# EAGLE schematic ODGIRON-v1.0-F103-0413 (EAGLE 9.6.2)
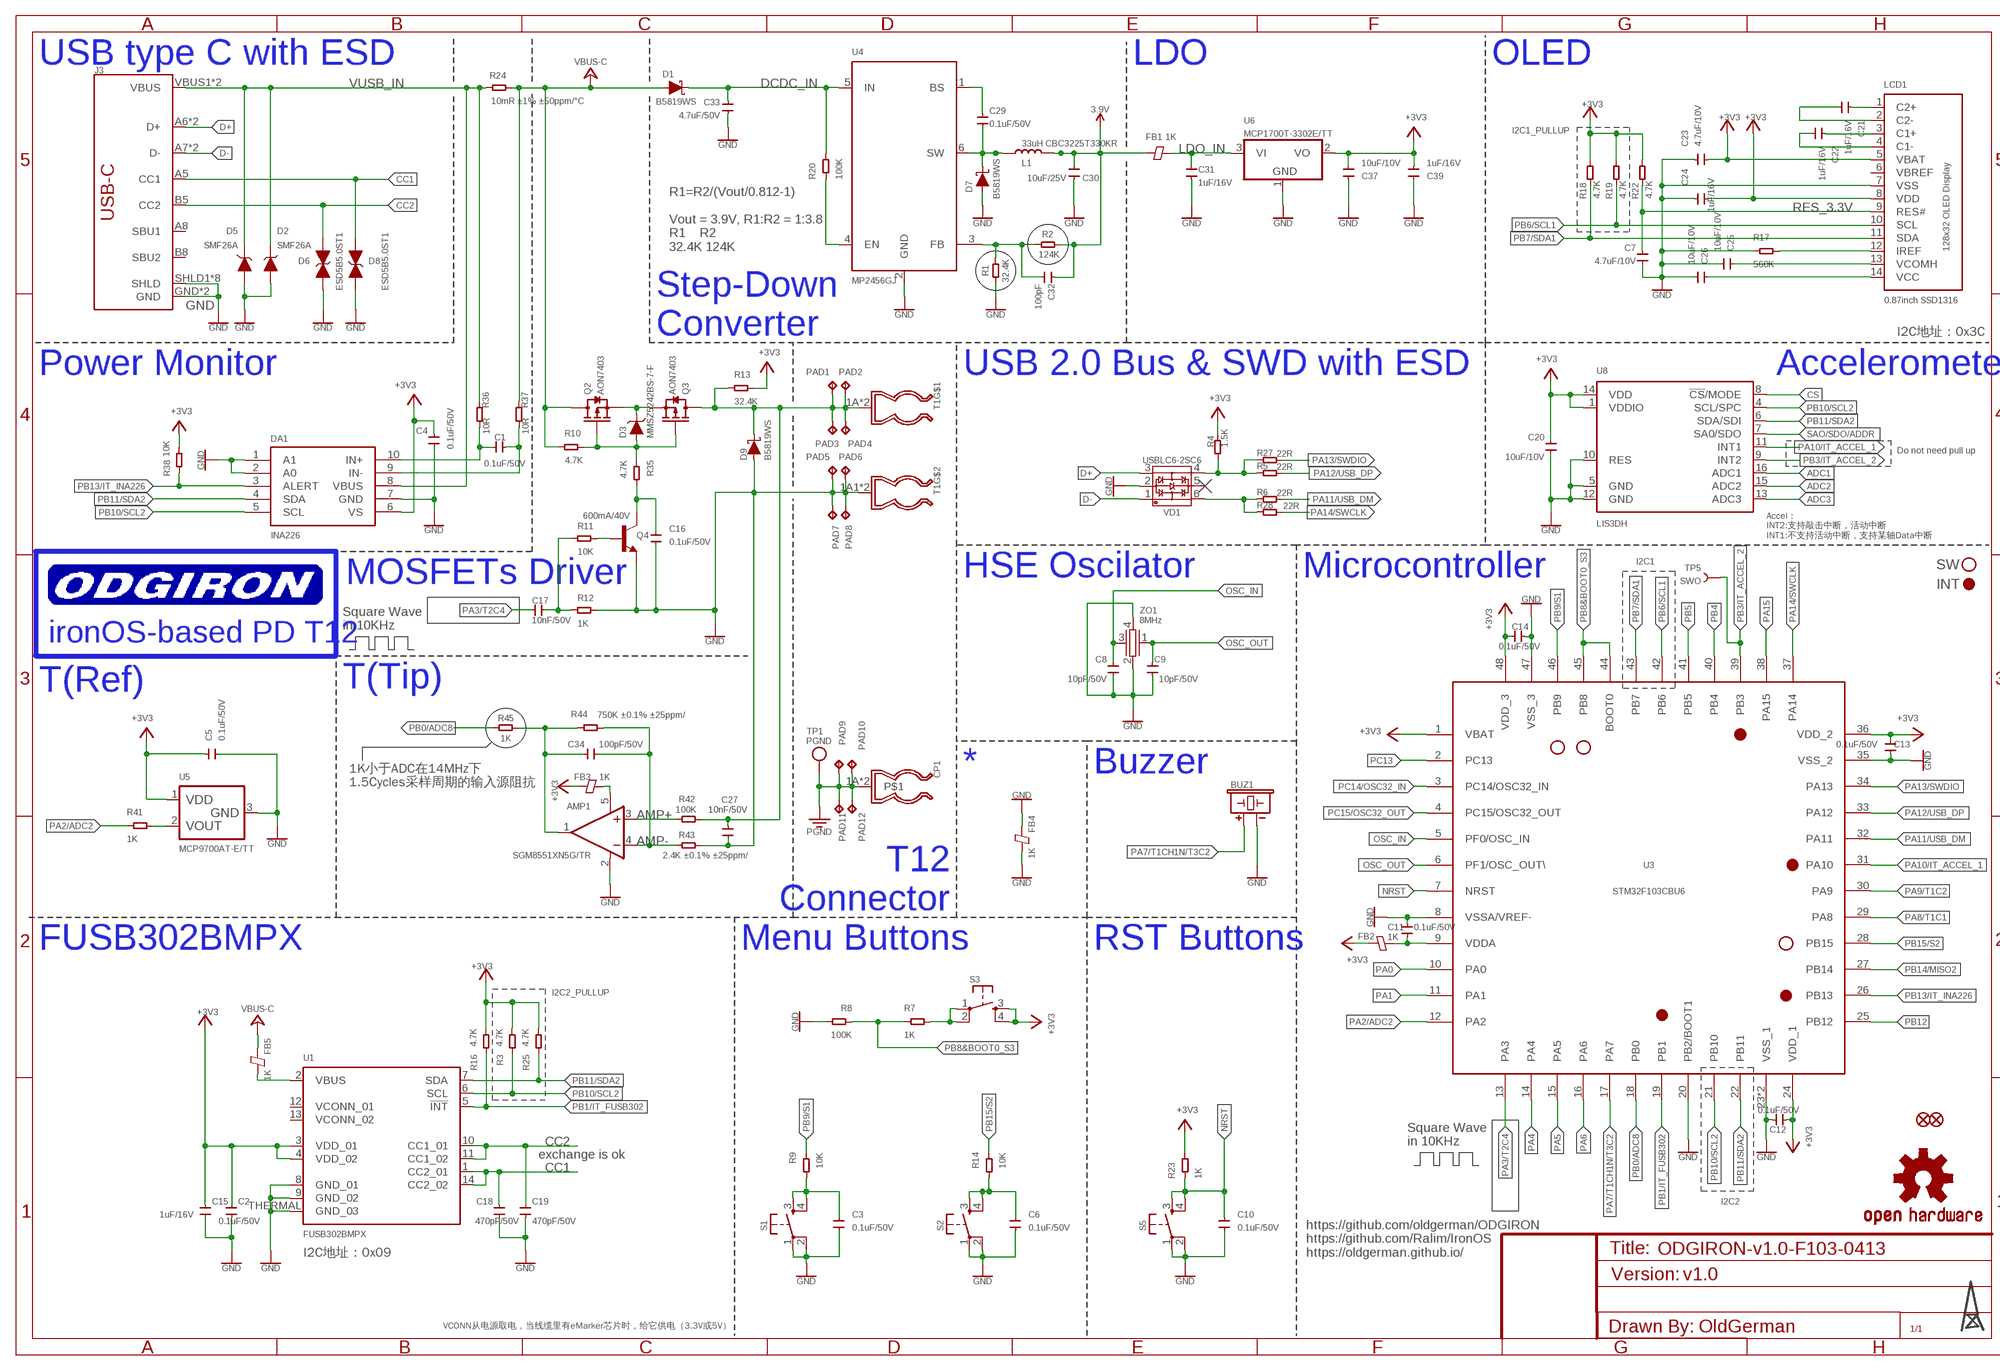
[diagram p0: schematic, sheet 1, part 1 of 2]
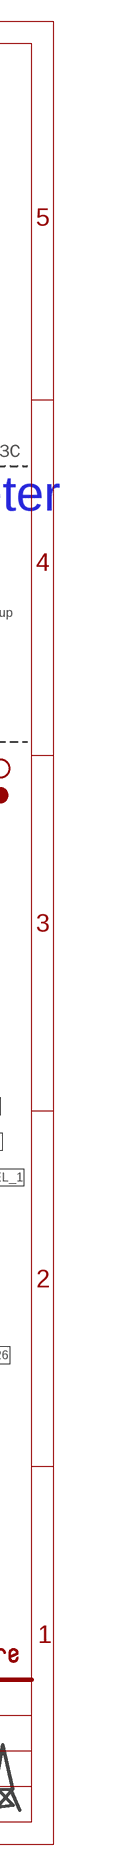
[diagram p1: schematic, sheet 1, part 2 of 2]

## Parts
AMP1  SGM8551XN5G/TR  AMP_SIMGLEN  [SOT23-5]
BUZ1  BUZZERBUZZER_5020  [BUZZER_5020]
C1  0.1uF/50V  SEEED_CAP-0603  [C0603]
C2  0.1uF/50V  SEEED_CAP-0603  [C0603]
C3  0.1uF/50V  SEEED_CAP-0603  [C0603]
C4  0.1uF/50V  SEEED_CAP-0603  [C0603]
C5  0.1uF/50V  SEEED_CAP-0603  [C0603]
C6  0.1uF/50V  SEEED_CAP-0603  [C0603]
C7  4.7uF/10V  SEEED_CAP-0603  [C0603]
C8  10pF/50V  SEEED_CAP-0603  [C0603]
C9  10pF/50V  SEEED_CAP-0603  [C0603]
C10  0.1uF/50V  SEEED_CAP-0603  [C0603]
C11  0.1uF/50V  SEEED_CAP-0603  [C0603]
C12  0.1uF/50V  SEEED_CAP-0603  [C0603]
C13  0.1uF/50V  SEEED_CAP-0603  [C0603]
C14  0.1uF/50V  SEEED_CAP-0603  [C0603]
C15  1uF/16V  SEEED_CAP-0603  [C0603]
C16  0.1uF/50V  SEEED_CAP-0603  [C0603]
C17  10nF/50V  SEEED_CAP-0603  [C0603]
C18  470pF/50V  SEEED_CAP-0603  [C0603]
C19  470pF/50V  SEEED_CAP-0603  [C0603]
C20  10uF/10V  SEEED_CAP-0603  [C0603]
C21  1uF/16V  SEEED_CAP-0603  [C0603]
C22  1uF/16V  SEEED_CAP-0603  [C0603]
C23  4.7uF/10V  SEEED_CAP-0603  [C0603]
C24  1uF/16V  SEEED_CAP-0603  [C0603]
C25  10uF/10V  SEEED_CAP-0603  [C0603]
C26  10uF/10V  SEEED_CAP-0603  [C0603]
C27  10nF/50V  SEEED_CAP-0603  [C0603]
C29  0.1uF/50V  SEEED_CAP-0603  [C0603]
C30  10uF/25V  SEEED_CAP-0805  [C0805]
C31  1uF/16V  SEEED_CAP-0603  [C0603]
C32  100pF  SEEED_CAP-0603  [C0603]
C33  4.7uF/50V  SEEED_CAP-0805  [C0805]
C34  100pF/50V  SEEED_CAP-0603  [C0603]
C37  10uF/10V  SEEED_CAP-0603  [C0603]
C39  1uF/16V  SEEED_CAP-0603  [C0603]
CP1  FUSE_CLIPS_01  [FUSE_CLIPS_01]
D1  B5819WS  DIODE_SCHOTTKYSOD323  [SOD-323]
D2  SMF26A  DIODE-TVS_UNIDIRECTIONALSOD-123  [SOD-123]
D3  MMSZ5242BS-7-F  DIODE_ZENERSOD-323  [SOD-323]
D5  SMF26A  DIODE-TVS_UNIDIRECTIONALSOD-123  [SOD-123]
D6  ESD5B5.0ST1  DIODE-TVS_BI−DIRECTIONALSOD-523  [SOD-523]
D7  B5819WS  DIODE_SCHOTTKYSOD323  [SOD-323]
D8  ESD5B5.0ST1  DIODE-TVS_BI−DIRECTIONALSOD-523  [SOD-523]
D9  B5819WS  DIODE_SCHOTTKYSOD323  [SOD-323]
DA1  INA226  [MSOP10]
FB1  1K  FERRITE-BEAD-0603  [F0603]
FB2  1K  FERRITE-BEAD-0603  [F0603]
FB3  1K  FERRITE-BEAD-0603  [F0603]
FB4  1K  FERRITE-BEAD-0603  [F0603]
FB5  1K  FERRITE-BEAD-0603  [F0603]
FID1  FIDUCIAL  [FIDUCIAL_1MM]
FID2  FIDUCIAL  [FIDUCIAL_1MM]
J3  USB_C_LONG-SYMBOL2-LAYER  [USB-C-16P]
L1  33uH CBC3225T330KR  INDUCTOR3225  [SMD,3.2X2.5X2.5MM]
LCD1  0.87inch SSD1316  0.87INCH_OLED_128X32_SSD1306  [0.87INCH_128X32_OLED_SSD1306]
LOGO1  OSHW-LOGONO_SILK  [DUMMY]
PAD1  PADTP16SQ  [TP16SQ]
PAD2  PADTP16SQ  [TP16SQ]
PAD3  PADTP16SQ  [TP16SQ]
PAD4  PADTP16SQ  [TP16SQ]
PAD5  PADTP16SQ  [TP16SQ]
PAD6  PADTP16SQ  [TP16SQ]
PAD7  PADTP16SQ  [TP16SQ]
PAD8  PADTP16SQ  [TP16SQ]
PAD9  PADTP16SQ  [TP16SQ]
PAD10  PADTP16SQ  [TP16SQ]
PAD11  PADTP16SQ  [TP16SQ]
PAD12  PADTP16SQ  [TP16SQ]
Q2  AON7403  MOSFET-P-AON7403  [DFN8P-0.65-3X3X0.8MM]
Q3  AON7403  MOSFET-P-AON7403  [DFN8P-0.65-3X3X0.8MM]
Q4  600mA/40V  TRANS_NPN-MMBT2222AL  [SOT23-3]
R1  32.4K  SEEED_RES-0603  [R0603]
R2  124K  SEEED_RES-0603  [R0603]
R3  4.7K  SEEED_RES-0603  [R0603]
R4  1.5K  SEEED_RES-0603  [R0603]
R5  22R  SEEED_RES-0603  [R0603]
R6  22R  SEEED_RES-0603  [R0603]
R7  1K  SEEED_RES-0603  [R0603]
R8  100K  SEEED_RES-0603  [R0603]
R9  10K  SEEED_RES-0603  [R0603]
R10  4.7K  SEEED_RES-0603  [R0603]
R11  10K  SEEED_RES-0603  [R0603]
R12  1K  SEEED_RES-0603  [R0603]
R13  32.4K  SEEED_RES-0603  [R0603]
R14  10K  SEEED_RES-0603  [R0603]
R16  4.7K  SEEED_RES-0603  [R0603]
R17  560K  SEEED_RES-0603  [R0603]
R18  4.7K  SEEED_RES-0603  [R0603]
R19  4.7K  SEEED_RES-0603  [R0603]
R20  100K  SEEED_RES-0603  [R0603]
R22  4.7K  SEEED_RES-0603  [R0603]
R23  1K  SEEED_RES-0603  [R0603]
R24  10mR ±1% ±50ppm/°C  SEEED_RES-1206  [R1206]
R25  4.7K  SEEED_RES-0603  [R0603]
R27  22R  SEEED_RES-0603  [R0603]
R28  22R  SEEED_RES-0603  [R0603]
R35  4.7K  SEEED_RES-0603  [R0603]
R36  10R  SEEED_RES-0603  [R0603]
R37  10R  SEEED_RES-0603  [R0603]
R38  10K  SEEED_RES-0603  [R0603]
R41  1K  SEEED_RES-0603  [R0603]
R42  100K  SEEED_RES-0603  [R0603]
R43  2.4K ±0.1% ±25ppm/℃  SEEED_RES-0603  [R0603]
R44  750K ±0.1% ±25ppm/℃  SEEED_RES-0603  [R0603]
R45  1K  SEEED_RES-0603  [R0603]
S1  TAC_SWITCHSMD  [TACTILE_SWITCH_SMD]
S2  TAC_SWITCHSMD  [TACTILE_SWITCH_SMD]
S3  TAC_SWITCHSMD  [TACTILE_SWITCH_SMD]
S5  TAC_SWITCHSMD  [TACTILE_SWITCH_SMD]
T1  HAKKO_T12_K-TYPE_WITH_FUSE_CLIPS_X2  [HAKKO_T12_K-TYPE_WITH_FUSE_CLIPS_X2]
TP1  PGND  TESTPOINTROUND2MM  [TESTPOINT_ROUND_2MM]
TP5  SWO  TEST-POINT3  [PAD.03X.03]
U1  FUSB302BMPX  FUSB302  [QFN14-2.5X2.5MM]
U3  STM32F103CBU6  STM32F1_QFN48  [QFN48_7X7MM_0.5MM]
U4  MP2456GJ  MP2456  [SOT23-6]
U5  MCP9700AT-E/TT  MCP9700  [SOT23-3@1]
U6  MCP1700T-3302E/TT  MCP1700  [SOT23-3]
U8  LIS3DH  [LGA-16-3X3]
VD1  USBLC6-2SC6  USBLC6-2SOT23-6  [SOT23-6]
ZO1  8MHz  3225_CRYSTALL  [3.2X2.5_KX-7]

## Nets
3.9V: C30.1 C32.1 FB1.1 L1.2 R2.1
+3V3: C2.1 C4.1 C5.1 C12.2 C13.2 C14.2 C15.1 C20.2 C23.2 C24.2 C37.2 C39.2 DA1.6(VS) FB2.2 FB3.2 LCD1.5(VBAT) LCD1.8(VDD) R3.1 R4.2 R13.2 R16.1 R18.2 R19.2 R22.2 R23.2 R25.1 R38.1 S3.3 S3.4 U1.3(VDD_01) U1.4(VDD_02) U3.1(VBAT) U3.24(VDD_1) U3.36(VDD_2) U3.48(VDD_3) U5.1(VDD) U6.2(VO) U8.1(VDDIO) U8.14(VDD)
ADC1: U8.16(ADC1)
ADC2: U8.15(ADC2)
ADC3: U8.13(ADC3)
AMP+: AMP1.3(+IN) R42.1
AMP-: AMP1.4(-IN) C34.2 R43.1 R44.2
BS: C29.1 U4.1(BS)
CC1: C18.1 D8.K(C) J3.A5(CC1) U1.1(CC2_01) U1.14(CC2_02)
CC2: C19.1 D6.K(C) J3.B5(CC2) U1.10(CC1_01) U1.11(CC1_02)
CS: U8.8(!CS!/MODE)
D+: J3.A6(D+) J3.B6(D+) VD1.3
D-: J3.A7(D-) J3.B7(D-) VD1.1
DCDC_IN: C33.1 D1.C R20.2 U4.5(IN)
EN: R20.1 U4.4(EN)
GND: AMP1.2(V-) BUZ1.-(LEAD-) C2.2 C3.2 C4.2 C5.2 C6.2 C7.2 C8.1 C9.1 C10.2 C11.1 C12.1 C13.1 C14.1 C15.2 C16.1 C18.2 C19.2 C20.1 C23.1 C24.1 C25.2 C26.2 C27.2 C30.2 C31.1 C33.2 C37.1 C39.1 D2.A D5.A D6.A D7.A D8.A D9.A DA1.1(A1) DA1.2(A0) DA1.7(GND) FB4.1 FB4.2 J3.GND J3.GND2(GND) J3.SHLD1(SHLD) J3.SHLD2(SHLD) J3.SHLD3(SHLD) J3.SHLD4(SHLD) J3.SHLD5(SHLD) J3.SHLD6(SHLD) J3.SHLD7(SHLD) J3.SHLD8(SHLD) LCD1.7(VSS) PAD5.TP PAD6.TP PAD7.TP PAD8.TP Q4.2(E) R1.1 R8.2 R12.1 R17.1 R43.2 S1.1 S1.2 S2.1 S2.2 S5.1 S5.2 T1.1A1 T1.1B1 U1.8(GND_01) U1.9(GND_02) U1.THERMAL(GND_03) U3.8(VSSA/VREF-) U3.20(PB2/BOOT1) U3.23(VSS_1) U3.35(VSS_2) U3.47(VSS_3) U3.P$1(VSS_1) U4.2(GND) U5.3(GND) U6.1(GND) U8.5(GND) U8.10(RES) U8.12(GND) VD1.2 ZO1.2 ZO1.4
LDO_IN: C31.2 FB1.2 U6.3(VI)
N$1: R4.1 R5.1 R27.1 VD1.4
N$2: R7.2 S3.1 S3.2
N$3: D3.C Q2.1(S) Q2.2(S) Q2.3(S) Q3.1(S) Q3.2(S) Q3.3(S)
N$4: C21.1 LCD1.1(C2+)
N$5: D3.A Q2.4(G) Q3.4(G) R10.2 R35.1
N$6: C22.1 LCD1.3(C1+)
N$7: C11.2 FB2.1 U3.9(VDDA)
N$8: C3.1 R9.2 S1.3 S1.4
N$11: C21.2 LCD1.2(C2-)
N$12: C6.1 R14.2 S2.3 S2.4
N$13: C22.2 LCD1.4(C1-)
N$14: C25.1 LCD1.13(VCOMH)
N$15: LCD1.12(IREF) R17.2
N$16: C26.1 LCD1.14(VCC)
N$17: Q4.1(B) R11.1
N$18: C32.2 R1.2 R2.2 U4.3(FB)
N$19: C16.2 Q4.3(C) R35.2
N$20: C17.1 R11.2 R12.2
N$21: AMP1.5(V+) FB3.1
N$22: R6.1 R28.1 VD1.6
N$23: FB5.1 U1.2(VBUS)
N$30: C1.1 DA1.10(IN+) R36.1
N$32: C1.2 DA1.9(IN-) R37.1
N$35: R41.2 U5.2(VOUT)
NRST: C10.1 R23.1 S5.3 S5.4 U3.7(NRST)
OSC_IN: C8.2 U3.5(PF0/OSC_IN) ZO1.3
OSC_OUT: C9.2 U3.6(PF1/OSC_OUT\) ZO1.1
OUT: AMP1.1(OUT) C34.1 R44.1 R45.2
PA0: U3.10(PA0)
PA1: U3.11(PA1)
PA2/ADC2: R41.1 U3.12(PA2)
PA3/T2C4: C17.2 U3.13(PA3)
PA4: U3.14(PA4)
PA5: U3.15(PA5)
PA6: U3.16(PA6)
PA7/T1CH1N/T3C2: BUZ1.+(LEAD+) U3.17(PA7)
PA8/T1C1: U3.29(PA8)
PA9/T1C2: U3.30(PA9)
PA10/IT_ACCEL_1: U3.31(PA10) U8.11(INT1)
PA11/USB_DM: R6.2 U3.32(PA11)
PA12/USB_DP: R5.2 U3.33(PA12)
PA13/SWDIO: R27.2 U3.34(PA13)
PA14/SWCLK: R28.2 U3.37(PA14)
PA15: U3.38(PA15)
PB0/ADC8: R45.1 U3.18(PB0)
PB1/IT_FUSB302: R16.2 U1.5(!INT) U3.19(PB1)
PB3/IT_ACCEL_2: TP5.P$1 U3.39(PB3) U8.9(INT2)
PB4: U3.40(PB4)
PB5: U3.41(PB5)
PB6/SCL1: LCD1.10(SCL) R19.1 U3.42(PB6)
PB7/SDA1: LCD1.11(SDA) R18.1 U3.43(PB7)
PB8&BOOT0_S3: R7.1 R8.1 U3.44(BOOT0) U3.45(PB8)
PB9/S1: R9.1 U3.46(PB9)
PB10/SCL2: DA1.5(SCL) R3.2 U1.6(SCL) U3.21(PB10) U8.4(SCL/SPC)
PB11/SDA2: DA1.4(SDA) R25.2 U1.7(SDA) U3.22(PB11) U8.6(SDA/SDI)
PB12: U3.25(PB12)
PB13/IT_INA226: DA1.3(ALERT) R38.2 U3.26(PB13)
PB14/MISO2: U3.27(PB14)
PB15/S2: R14.1 U3.28(PB15)
PC13: U3.2(PC13)
PC14/OSC32_IN: U3.3(PC14/OSC32_IN)
PC15/OSC32_OUT: U3.4(PC15/OSC32_OUT)
PGND: CP1.1A CP1.1B PAD9.TP PAD10.TP PAD11.TP PAD12.TP TP1.P$1
RES_3.3V: C7.1 LCD1.9(RES#) R22.1
SAO/SDO/ADDR: U8.7(SA0/SDO)
SW: C29.2 D7.C L1.1 U4.6(SW)
T12+: C27.1 D9.C PAD1.TP PAD2.TP PAD3.TP PAD4.TP Q3.5(D) Q3.6(D) Q3.7(D) Q3.8(D) Q3.9(D) R13.1 R42.2 T1.1A T1.1B
VBUS-C: D1.A FB5.2 Q2.5(D) Q2.6(D) Q2.7(D) Q2.8(D) Q2.9(D) R10.1 R24.1 R37.2
VUSB_IN: D2.C(K) D5.C(K) DA1.8(VBUS) J3.VBUS1(VBUS) J3.VBUS2(VBUS) R24.2 R36.2
Unconnected: J3.A8(SBU1) J3.B8(SBU2) U1.12(VCONN_01) U1.13(VCONN_02) VD1.5

## Notes on the sheet
- USB type C with ESD | LDO | OLED
- I2C1_PULLUP
- R1=R2/(Vout/0.812-1)
  
  Vout = 3.9V, R1:R2 = 1:3.8
  R1    R2
  32.4K 124K
- Step-Down
  Converter
- I2C地址：0x3C
- Power Monitor | USB 2.0 Bus & SWD with ESD | Accelerometer
- Do not need pull up
- Accel：
  INT2:支持敲击中断，活动中断
  INT1:不支持活动中断，支持某轴Data中断
- I2C1 | SW
- MOSFETs Driver | HSE Oscilator | Microcontroller
- INT
- Square Wave
  in 10KHz
- ironOS-based PD T12
- T(Ref) | T(Tip)
- * | Buzzer
- 1K小于ADC在14MHz下
  1.5Cycles采样周期的输入源阻抗
- T12
  Connector
- FUSB302BMPX | Menu Buttons | RST Buttons
- I2C2_PULLUP
- Square Wave
  in 10KHz
- exchange is ok
- I2C2
- FUSB302 | ACCEL+2 | SW | SW | ACCEL_1 | INA226 | SW
- I2C地址：0x09
- https://github.com/oldgerman/ODGIRON
  https://github.com/Ralim/IronOS
  https://oldgerman.github.io/
- F103C8,F411: 0, 1, 2, 3, 4, 5-9, 10-15
  F072:0-1, 2-3, 4-15
- v1.0
- FUSB302 | ACCEL_2 | SW | SW | ACCEL_1 | INA226 | SW
- OldGerman
- VCONN从电源取电，当线缆里有eMarker芯片时，给它供电（3.3V或5V）

## Power pins joined to a net without a drawn wire
VBREF: LCD1.6(VBREF)

## Library data of the parts
AMP1 = TS100:AMP_SIMGLE: Rail-to-Rail Operational Amplifiers Single-Supply, MicroAmplifier(TM) Series; MPN: OPA340NA/3KG4; OC_FARNELL: 1234805; OC_NEWARK: 13M5177
BUZ1 = TS100:BUZZER
C1-C27 C29-C34 C37 C39 = TS100:SEEED_CAP: Ceramic Capacitors
CP1 = TS100:FUSE_CLIPS_01: FUSE 5 x 20 mm
D1 D7 D9 = TS100:DIODE_SCHOTTKY
D2 D5 = TS100:DIODE-TVS_UNIDIRECTIONAL
D3 = TS100:DIODE_ZENER
D6 D8 = TS100:DIODE-TVS_BI−DIRECTIONAL
DA1 = TS100:INA226: Lithium-Polymer/Lithium-Ion Battery Charger [Part No.] Microchip MCP73833 MSOP10 (tube only): Digikey: MCP73833T-AMI/UN or MCP73833-FCI/UN-ND Mouser: 579-MCP73833-AMI/UN DFN10 (tape): Digikey: Note Chips ending in 'AMI' have no timer, and chips ending in 'FCI' have a 6-hour timer that will end the charge sequence after 6 horus regqrdless of current charge level.
FB1-FB5 = TS100:FERRITE-BEAD
FID1 FID2 = TS100:FIDUCIAL: Fiducial Alignment Points Various fiducial points for machine vision alignment.
J3 = FUSB302:USB_C_LONG-SYMBOL: USB Type C 16Pin Connector Super Speed pins not available on the 16-pin purely SMD connector so this part is best for USB 2.0 implementations. D1 and D2 are tied together enabling D+/- no matter which way the cable is plugged into the connector. The two channel configuration pins (CC1/2) are exposed. These are normally connected to ground via 5.1k resistors but can be reconfigured for high current/high power applications.; PROD_ID: CONN-14122
L1 = TS100:INDUCTOR
LCD1 = TS100:0.87INCH_OLED_128X32_SSD1306: 128x32 I2C 0.91" Monochrome OLED Display
LOGO1 = SparkFun-Aesthetics:OSHW-LOGO: Open-Source Hardware (OSHW) Logo This logo indicates the piece of hardware it is found on incorporates a OSHW license and/or adheres to the definition of open source hardware found here: http://freedomdefined.org/OSHW
PAD1-PAD12 = TS100:PAD: Test pad
Q2 Q3 = TS100:MOSFET-P
Q4 = SparkFun-DiscreteSemi:TRANS_NPN: NPN transistor Current controlled devices typically used to amplify current or used as a switch. BC547 - COM-08928 <http://www.sparkfun.com/products/8928> (TO-92 45V 100mA) (1.Collector 2.Base 3.Emitter) 2N3904 - COM-00521 <http://www.sparkfun.com/products/521> (TO-92 40V 200mA) (1.Emitter 2.Base 3.Collector) P2N2222A - COM-12852 <http://www.sparkfun.com/products/12852> (TO-92 40V 600mA) (1.Collector 2.Base 3.Emitter); PROD_ID: TRANS-08049
R1-R14 R16-R20 R22-R25 R27 R28 R35-R38 R41-R45 = TS100:SEEED_RES
S1-S3 = TS100:TAC_SWITCH: Momentary Switch Button commonly used for reset or general input. Spark Fun Electronics SKU : COM-00097
S5 = untitled:TAC_SWITCH: Momentary Switch Button commonly used for reset or general input. Spark Fun Electronics SKU : COM-00097
T1 = T12_FUSE_CLIPS:HAKKO_T12_K-TYPE_WITH_FUSE_CLIPS_X2
TP1 = microbuilder:TESTPOINT: Test Point Various test points for characterisation and PCB testing TESTPOINT_SMT - Compact Surface Mount Test Point [Digikey: 5016KTR-ND]
TP5 = SparkFun-Connectors-psa-change-usb-c:TEST-POINT: SparkFun Test Points Bare copper test points for troubleshooting or In-Circuit-Testing. These are used by our Production team for verifying production board runs using pogo-pins on test beds. SparkFun Products: SparkFun LSM9DS1 Breakout <https://www.sparkfun.com/products/13284> SparkFun PSOC <https://www.sparkfun.com/products/13714> SparkFun Load Cell Amplifier <https://www.sparkfun.com/products/13879>
U1 = FUSB302:FUSB302: Espressif ESP8266 WiFi/Microcontroller SoC The ESP8266 WiFi Module is a self contained SOC with integrated TCP/IP protocol stack that can give any microcontroller access to your WiFi network. The ESP8266 is capable of either hosting an application or offloading all Wi-Fi networking functions from another application processor. SparkFun Products WiFi Module ESP8266 <https://www.sparkfun.com/products/13678> (WRL-13678) SparkFun ESP8266 Thing <https://www.sparkfun.com/products/13231> (WRL-13231) SparkFun WiFi Shield - ESP8266 <https://www.sparkfun.com/products/13287> (WRL-13287) SparkFun ESP8266 Thing - Dev Board <https://www.sparkfun.com/products/13711> (WRL-13711) SparkFun Blynk Board - ESP8266 <https://www.sparkfun.com/products/13794> (WRL-13794); PROD_ID: IC-12452
U3 = STM32:STM32F1_QFN48
U4 = TS100:MP2456
U5 = TS100:MCP9700
U6 = TS100:MCP1700
U8 = SparkFun-Sensors:LIS3DH: ST Microelectronics LIS3DH 3-Axis ±2/4/8/16g SPI/I2C Accelerometer The LIS3DH is a three axis MEMS linear accelerometer in the "nano" family. It has a digital I2C/SPI serial interface which makes it ideal for using in embedded applications. The device also features ultra low-power operational modes that allow advanced power saving and smart sleep to wake-up functions, built in detections with interrupts, and auxiliary ADC inputs Datasheet-XXXX <http://www.sparkfun.com/datasheets/Sensors/Accelerometer/LIS3DH.pdf> SparkFun Products SparkFun Triple Axis Accelerometer Breakout - LIS3DH <https://www.sparkfun.com/products/10345> (SEN-XXXXX) Triple Axis Accelerometer - LIS3DH <https://www.sparkfun.com/products/9755> (SEN-XXXXX); PROD_ID: IC-13419; SF_ID: N/A
VD1 = ESD-protection:USBLC6-2
ZO1 = DIP:3225_CRYSTALL